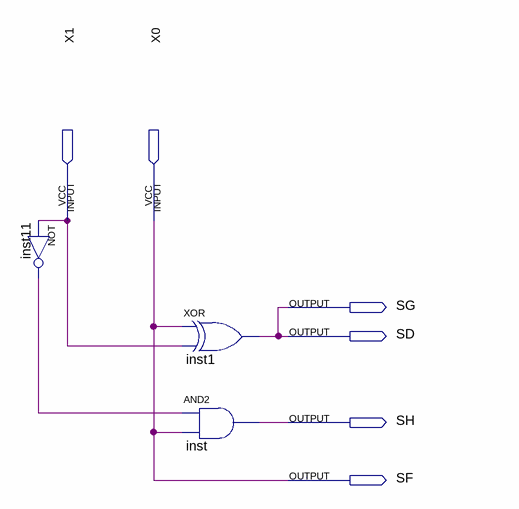
[diagram p0: schematic sheet]
// Quartus schematic Decodificador2x8Soma.bdf as structural Verilog: 3 symbols, 6 pins
module Decodificador2x8Soma (
  input  X1,
  input  X0,
  output SG,
  output SD,
  output SH,
  output SF
);

  wire inst11_out;

  not inst11 (inst11_out, X1);
  xor inst1 (SD, X0, X1);
  and inst (SH, inst11_out, X0);

  assign SF = X0;
  assign SG = SD;
endmodule
